# EAGLE schematic ESCv1 (EAGLE 6.1)
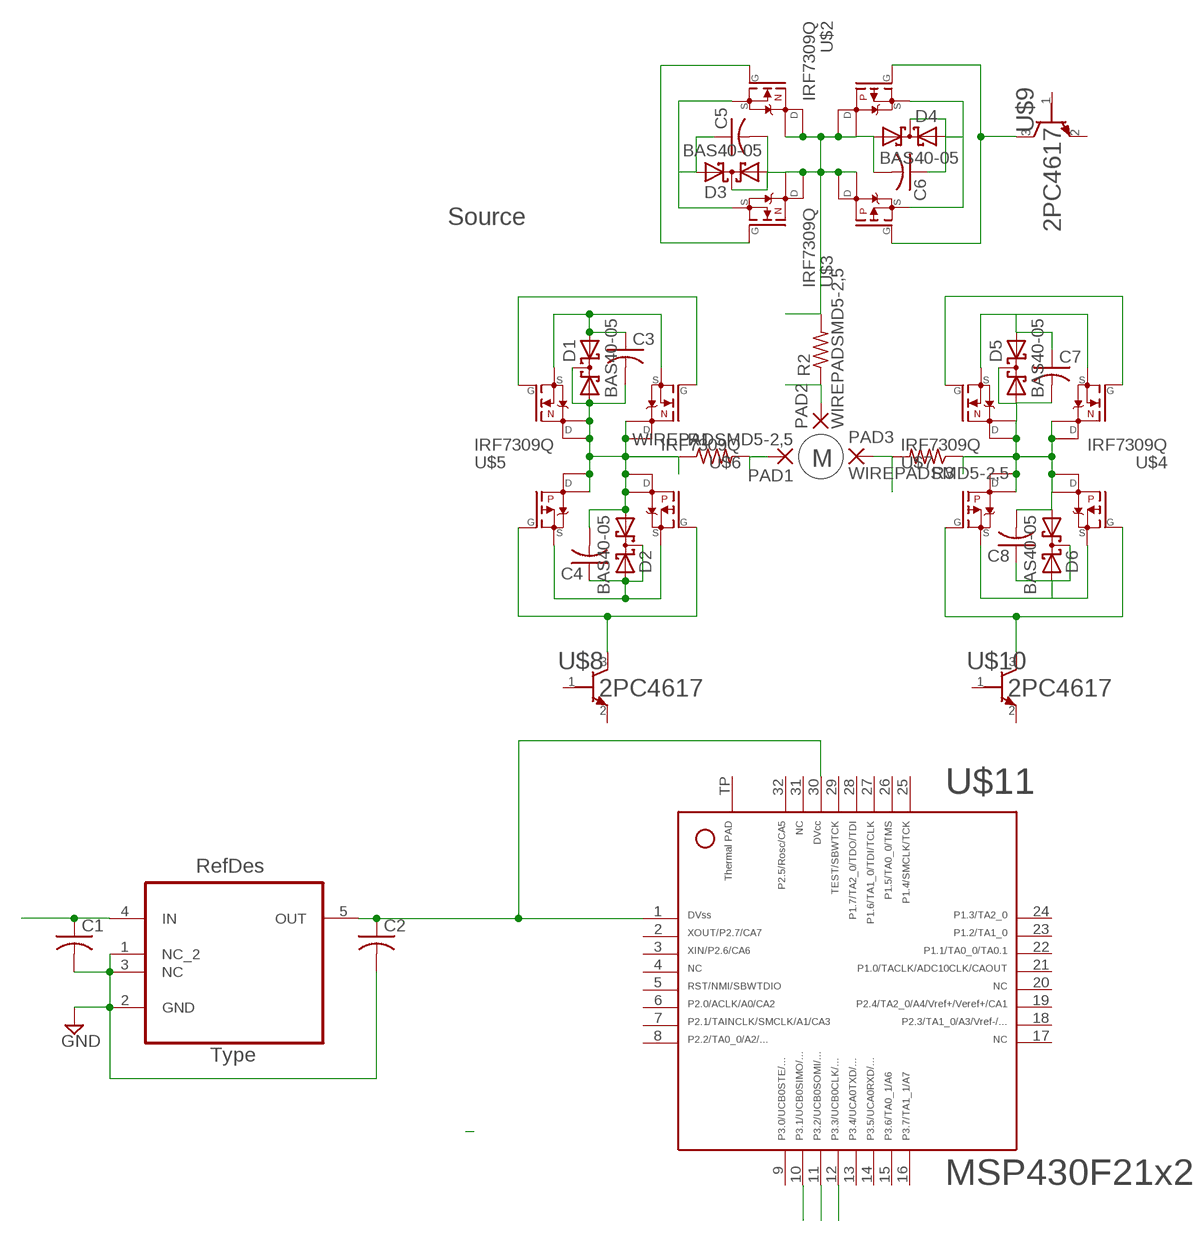
[diagram p0: schematic, sheet 1]

## Parts
C1  C-USC0201  [C0201]
C2  C-USC0201  [C0201]
C3  C-USC0402K  [C0402K]
C4  C-USC0402K  [C0402K]
C5  C-USC0402K  [C0402K]
C6  C-USC0402K  [C0402K]
C7  C-USC0402K  [C0402K]
C8  C-USC0402K  [C0402K]
D1  BAS40-05  [SOT23]
D2  BAS40-05  [SOT23]
D3  BAS40-05  [SOT23]
D4  BAS40-05  [SOT23]
D5  BAS40-05  [SOT23]
D6  BAS40-05  [SOT23]
PAD1  WIREPADSMD5-2,5  [5-2,5]
PAD2  WIREPADSMD5-2,5  [5-2,5]
PAD3  WIREPADSMD5-2,5  [5-2,5]
R1  R-US_R2512W  [R2512W]
R2  R-US_R2512W  [R2512W]
R3  R-US_R2512W  [R2512W]
U1  TPS71525DCKR  [SOT65P210X110-5N]
U$2  IRF7309Q  [SO-8]
U$3  IRF7309Q  [SO-8]
U$4  IRF7309Q  [SO-8]
U$5  IRF7309Q  [SO-8]
U$6  IRF7309Q  [SO-8]
U$7  IRF7309Q  [SO-8]
U$8  2PC4617  [SOT-416]
U$9  2PC4617  [SOT-416]
U$10  2PC4617  [SOT-416]
U$11  F21X2---RHB32  [RHB32]

## Nets
GND: C1.2 C2.2 U1.1(NC_2) U1.2(GND) U1.3(NC)
N$1: C5.2 C6.2 D3.1(A1) D3.3(C) D4.1(A1) R2.2 U$2.5(P-D$1) U$2.6(P-D$2) U$2.7(N-D$2) U$2.8(N-D$1) U$3.5(P-D$1) U$3.6(P-D$2) U$3.7(N-D$2) U$3.8(N-D$1)
N$2: C1.1 U1.4(IN)
N$3: C2.1 U1.5(OUT) U$11.1 U$11.30
N$4: U$2.2(N-G) U$3.2(N-G)
N$5: C7.2 C8.2 D5.1(A1) D5.3(C) D6.1(A1) R3.1 U$4.5(P-D$1) U$4.6(P-D$2) U$4.7(N-D$2) U$4.8(N-D$1) U$7.5(P-D$1) U$7.6(P-D$2) U$7.7(N-D$2) U$7.8(N-D$1)
N$6: U$2.4(P-G) U$3.4(P-G) U$9.P$3
N$7: C3.2 C4.2 D1.1(A1) D1.3(C) D2.1(A1) R1.1 U$5.5(P-D$1) U$5.6(P-D$2) U$5.7(N-D$2) U$5.8(N-D$1) U$6.5(P-D$1) U$6.6(P-D$2) U$6.7(N-D$2) U$6.8(N-D$1)
N$8: PAD1.1(P) R1.2
N$9: C5.1 D3.2(A2) U$2.1(N-S) U$3.1(N-S)
N$10: U$4.4(P-G) U$7.4(P-G) U$10.P$3
N$11: PAD2.1(P) R2.1
N$12: PAD3.1(P) R3.2
N$13: U$5.4(P-G) U$6.4(P-G) U$8.P$3
N$14: U$5.2(N-G) U$6.2(N-G)
N$15: C3.1 D1.2(A2) U$5.1(N-S) U$6.1(N-S)
N$16: C6.1 D4.2(A2) D4.3(C) U$2.3(P-S) U$3.3(P-S)
N$17: U$4.2(N-G) U$7.2(N-G)
N$18: C4.1 D2.2(A2) D2.3(C) U$5.3(P-S) U$6.3(P-S)
N$20: C7.1 D5.2(A2) U$4.1(N-S) U$7.1(N-S)
N$21: C8.1 D6.2(A2) D6.3(C) U$4.3(P-S) U$7.3(P-S)
N$23: U$11.10
N$24: U$11.11
N$25: U$11.12
Unconnected: U$8.P$1 U$8.P$2 U$9.P$1 U$9.P$2 U$10.P$1 U$10.P$2 U$11.2 U$11.3 U$11.4 U$11.5 U$11.6 U$11.7 U$11.8 U$11.9 U$11.13 U$11.14 U$11.15 U$11.16 U$11.17 U$11.18 U$11.19 U$11.20 U$11.21 U$11.22 U$11.23 U$11.24 U$11.25 U$11.26 U$11.27 U$11.28 U$11.29 U$11.31 U$11.32

## Notes on the sheet
- Source
- M

## Power pins joined to a net without a drawn wire
33: U$11.TP

## Library data of the parts
C1-C8 = rcl:C-US: CAPACITOR, American symbol
D1-D6 = diode:BAS40-05: Silicon Schottky Diodes General-purpose diode for high-speed switching
PAD1-PAD3 = wirepad:WIREPAD: Wire PAD connect wire on PCB
R1-R3 = rcl:R-US_: RESISTOR, American symbol
U1 = TI_TPS:TPS71525DCKR; DESCRIPTION: Linear Regulator; MPN: TPS71525DCKR; OC_FARNELL: 1703398; OC_NEWARK: 77C0814; PACKAGE: SC-70-5; SUPPLIER: Texas Instruments
U$2-U$7 = IR-HEXFET:IRF7309Q: HEXFET Power MOSFET
U$8-U$10 = NXP:2PC4617: NPN transistor in a SOT416 (SC-75) plastic package. Low current (max. 150 mA) Low voltage (max. 50 V)
U$11 = TI_MSP430_v16:F21X2---RHB32: *** MSP430F21x2 *** RHB32